# EAGLE design TouchDRO (EAGLE 7.5.0)
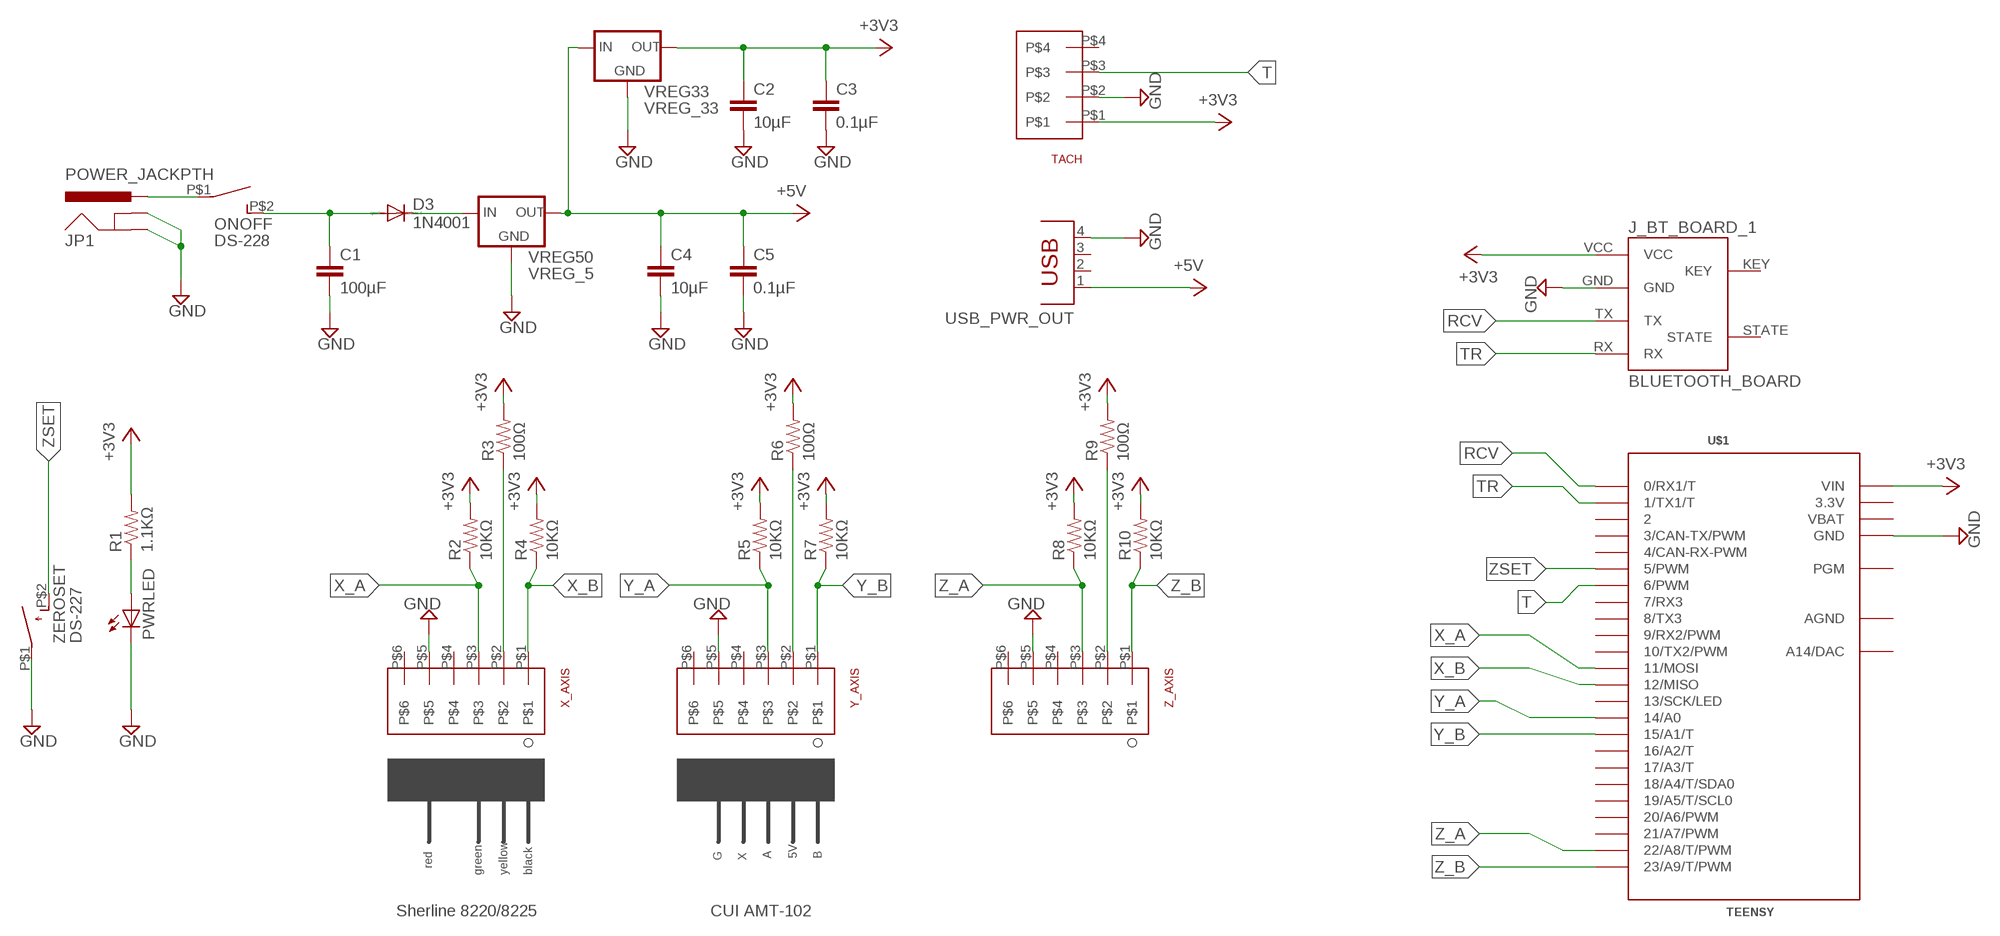
[diagram p0: schematic, sheet 1]

## Parts
C1  100µF  CAPEZ  [CAP-PTH-SMALLEZ]
C2  10µF  CAPEZ  [CAP-PTH-SMALLEZ]
C3  0.1µF  CAPEZ  [CAP-PTH-SMALLEZ]
C4  10µF  CAPEZ  [CAP-PTH-SMALLEZ]
C5  0.1µF  CAPEZ  [CAP-PTH-SMALLEZ]
D3  1N4001  DIODE-DO41-10  [DO41-10]
J_BT_BOARD_1  BLUETOOTH_BOARD  [BT_BOARD_FOOTPRINT]
JP1  POWER_JACKPTH  [POWER_JACK_PTH]
ONOFF  DS-228  [DS-EXT]
PWRLED  LED3MM  [LED3MM]
R1  1.1KΩ  RESISTOREZ  [AXIAL-0.3EZ]
R2  10KΩ  RESISTOREZ  [AXIAL-0.3EZ]
R3  100Ω  RESISTOREZ  [AXIAL-0.3EZ]
R4  10KΩ  RESISTOREZ  [AXIAL-0.3EZ]
R5  10KΩ  RESISTOREZ  [AXIAL-0.3EZ]
R6  100Ω  RESISTOREZ  [AXIAL-0.3EZ]
R7  10KΩ  RESISTOREZ  [AXIAL-0.3EZ]
R8  10KΩ  RESISTOREZ  [AXIAL-0.3EZ]
R9  100Ω  RESISTOREZ  [AXIAL-0.3EZ]
R10  10KΩ  RESISTOREZ  [AXIAL-0.3EZ]
TACH  KF2510_4PIN  [KF2510_4PIN]
U$1  TEENSY  TEENSY_3.1_BASIC  [TEENSY_3.1_BASIC]
USB_PWR_OUT  USBTYPEA  [USBTYPEA]
VREG33  VREG_33  [TO220]
VREG50  VREG_5  [TO220]
X_AXIS  KF2510_6PIN  [KF2510_6PIN]
Y_AXIS  KF2510_6PIN  [KF2510_6PIN]
Z_AXIS  KF2510_6PIN  [KF2510_6PIN]
ZEROSET  DS-227  [DS-EXT]

## Nets
+3V3: C2.1 C3.1 J_BT_BOARD_1.VCC R1.P$2 R2.P$2 R3.P$2 R4.P$2 R5.P$2 R6.P$2 R7.P$2 R8.P$2 R9.P$2 R10.P$2 TACH.P$1 U$1.VIN VREG33.OUT
+5V: C4.1 C5.1 USB_PWR_OUT.1 VREG33.IN VREG50.OUT
D1: D3.C VREG50.IN
GND: C1.2 C2.2 C3.2 C4.2 C5.2 J_BT_BOARD_1.GND JP1.GND JP1.GNDBREAK PWRLED.K(C) TACH.P$2 U$1.GND U$1.GND1(GND) USB_PWR_OUT.4 VREG33.GND VREG50.GND X_AXIS.P$5 Y_AXIS.P$5 Z_AXIS.P$5 ZEROSET.P$1(P)
N$1: PWRLED.A R1.P$1
N$3: R9.P$1 Z_AXIS.P$2
N$5: R6.P$1 Y_AXIS.P$2
N$6: JP1.PWR ONOFF.P$1(P)
N$7: R3.P$1 X_AXIS.P$2
ONOFF: C1.1 D3.A ONOFF.P$2(S)
RCV: J_BT_BOARD_1.TX U$1.0(0/RX1/T)
T: TACH.P$3 U$1.6(6/PWM)
TR: J_BT_BOARD_1.RX U$1.1(1/TX1/T)
X_A: R2.P$1 U$1.11(11/MOSI) X_AXIS.P$3
X_B: R4.P$1 U$1.12(12/MISO) X_AXIS.P$1
Y_A: R5.P$1 U$1.14/A0 Y_AXIS.P$3
Y_B: R7.P$1 U$1.15/A1(15/A1/T) Y_AXIS.P$1
Z_A: R8.P$1 U$1.22/A8(22/A8/T/PWM) Z_AXIS.P$3
Z_B: R10.P$1 U$1.23/A9(23/A9/T/PWM) Z_AXIS.P$1
ZSET: U$1.5(5/PWM) ZEROSET.P$2(S)
Unconnected: J_BT_BOARD_1.KEY J_BT_BOARD_1.STATE TACH.P$4 U$1.2 U$1.3(3/CAN-TX/PWM) U$1.4(4/CAN-RX-PWM) U$1.7(7/RX3) U$1.8(8/TX3) U$1.9(9/RX2/PWM) U$1.10(10/TX2/PWM) U$1.13(13/SCK/LED) U$1.16/A2(16/A2/T) U$1.17/A3(17/A3/T) U$1.18/A4(18/A4/T/SDA0) U$1.19/A5(19/A5/T/SCL0) U$1.20/A6(20/A6/PWM) U$1.21/A7(21/A7/PWM) U$1.A14(A14/DAC) U$1.PGM USB_PWR_OUT.2 USB_PWR_OUT.3 X_AXIS.P$4 X_AXIS.P$6 Y_AXIS.P$4 Y_AXIS.P$6 Z_AXIS.P$4 Z_AXIS.P$6

## Notes on the sheet
- G | X | A | 5V | B
- red
- green | yellow | black
- Sherline 8220/8225 | CUI AMT-102

## Power pins joined to a net without a drawn wire
3.3V: U$1.3.3V U$1.3.3V1(3.3V)
AGND: U$1.AGND
VBAT: U$1.VBAT

## Library data of the parts
C1-C5 = SparkFun-Passives:CAP: Capacitor Standard 0603 ceramic capacitor, and 0.1" leaded capacitor.
D3 = diode:DIODE-: DIODE
J_BT_BOARD_1 = Bluetooth HC-05:BLUETOOTH_BOARD: Bluetooth Board V1.05
JP1 = SparkFun-Connectors:POWER_JACK: Power Jack This is the standard 5.5mm barrel jack for power. The PTH is the most common, proven, reliable, footprint. The Slot footprint only works if the mill layer is transmitted to the PCB fab house so be warned. Mating wall wart : TOL-00298 (and others); PROD_ID: CONN-08197
ONOFF = Switches:DS-228
PWRLED = led:LED: LED OSRAM: - CHIPLED LG R971, LG N971, LY N971, LG Q971, LY Q971, LO R971, LY R971 LH N974, LH R974 LS Q976, LO Q976, LY Q976 LO Q996 - Hyper CHIPLED LW Q18S LB Q993, LB Q99A, LB R99A - SideLED LS A670, LO A670, LY A670, LG A670, LP A670 LB A673, LV A673, LT A673, LW A673 LH A674 LY A675 LS A676, LA A676, LO A676, LY A676, LW A676 LS A679, LY A679, LG A679 - Hyper Micro SIDELED® LS Y876, LA Y876, LO Y876, LY Y876 LT Y87S - SmartLED LW L88C, LW L88S LB L89C, LB L89S, LG L890 LS L89K, LO L89K, LY L89K LS L896, LA L896, LO L896, LY L896 - TOPLED LS T670, LO T670, LY T670, LG T670, LP T670 LSG T670, LSP T670, LSY T670, LOP T670, LYG T670 LG T671, LOG T671, LSG T671 LB T673, LV T673, LT T673, LW T673 LH T674 LS T676, LA T676, LO T676, LY T676, LB T676, LH T676, LSB T676, LW T676 LB T67C, LV T67C, LT T67C, LS T67K, LO T67K, LY T67K, LW E67C LS E67B, LA E67B, LO E67B, LY E67B, LB E67C, LV E67C, LT E67C LW T67C LS T679, LY T679, LG T679 LS T770, LO T770, LY T770, LG T770, LP T770 LB T773, LV T773, LT T773, LW T773 LH T774 LS E675, LA E675, LY E675, LS T675 LS T776, LA T776, LO T776, LY T776, LB T776 LHGB T686 LT T68C, LB T68C - Hyper Mini TOPLED® LB M676 - Mini TOPLED Santana® LG M470 LS M47K, LO M47K, LY M47K Source: http://www.osram.convergy.de LUXEON: - LUMILED® LXK2-PW12-R00, LXK2-PW12-S00, LXK2-PW14-U00, LXK2-PW14-V00 LXK2-PM12-R00, LXK2-PM12-S00, LXK2-PM14-U00 LXK2-PE12-Q00, LXK2-PE12-R00, LXK2-PE12-S00, LXK2-PE14-T00, LXK2-PE14-U00 LXK2-PB12-K00, LXK2-PB12-L00, LXK2-PB12-M00, LXK2-PB14-N00, LXK2-PB14-P00, LXK2-PB14-Q00 LXK2-PR12-L00, LXK2-PR12-M00, LXK2-PR14-Q00, LXK2-PR14-R00 LXK2-PD12-Q00, LXK2-PD12-R00, LXK2-PD12-S00 LXK2-PH12-R00, LXK2-PH12-S00 LXK2-PL12-P00, LXK2-PL12-Q00, LXK2-PL12-R00 Source: www.luxeon.com KINGBRIGHT: KA-3528ASYC Source: www.kingbright.com
R1-R10 = SparkFun-Passives:RESISTOR: Resistor Basic schematic elements and footprints for 0603, 1206, and PTH resistors.
TACH = Connectors:KF2510_4PIN
U$1 = Teensy_3_Series_Board_v1.0:TEENSY_3.1_BASIC: Footprint for Teensy 3.1 board using all pin connections on the outer perimeter
USB_PWR_OUT = USB:USBTYPEA: BERG USB connector; OC_FARNELL: unknown; OC_NEWARK: unknown
VREG33 = regulators:VREG_33: Voltage Regulator Standard LM317 adjustable voltage regulator. AOI (Adjust Output Input). Google 'LM317 Calculator' for easy to use app to get the two resistor values needed. 240/720 for 5V output. 240/390 for 3.3V output. Spark Fun Electronics SKU : COM-00527
VREG50 = regulators:VREG_5: Voltage Regulator Standard 3.3V
X_AXIS Y_AXIS Z_AXIS = Connectors:KF2510_6PIN
ZEROSET = Switches:DS-227

## Board
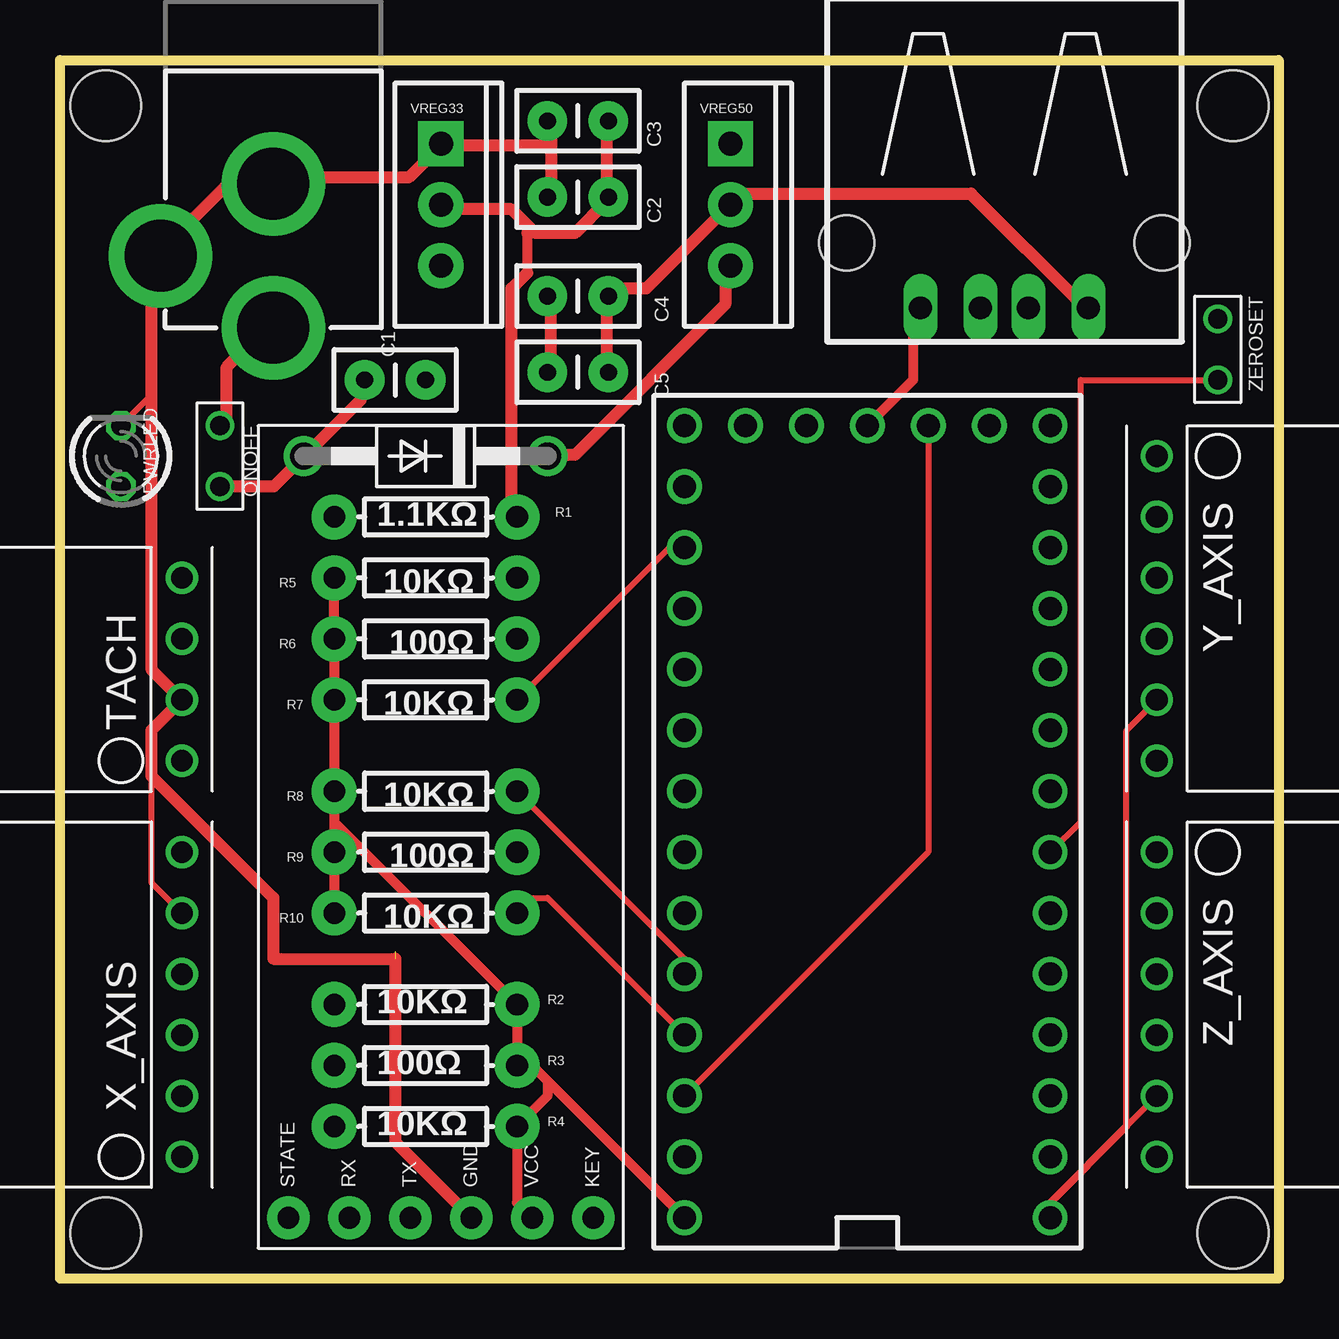
[diagram p1: board, top side]
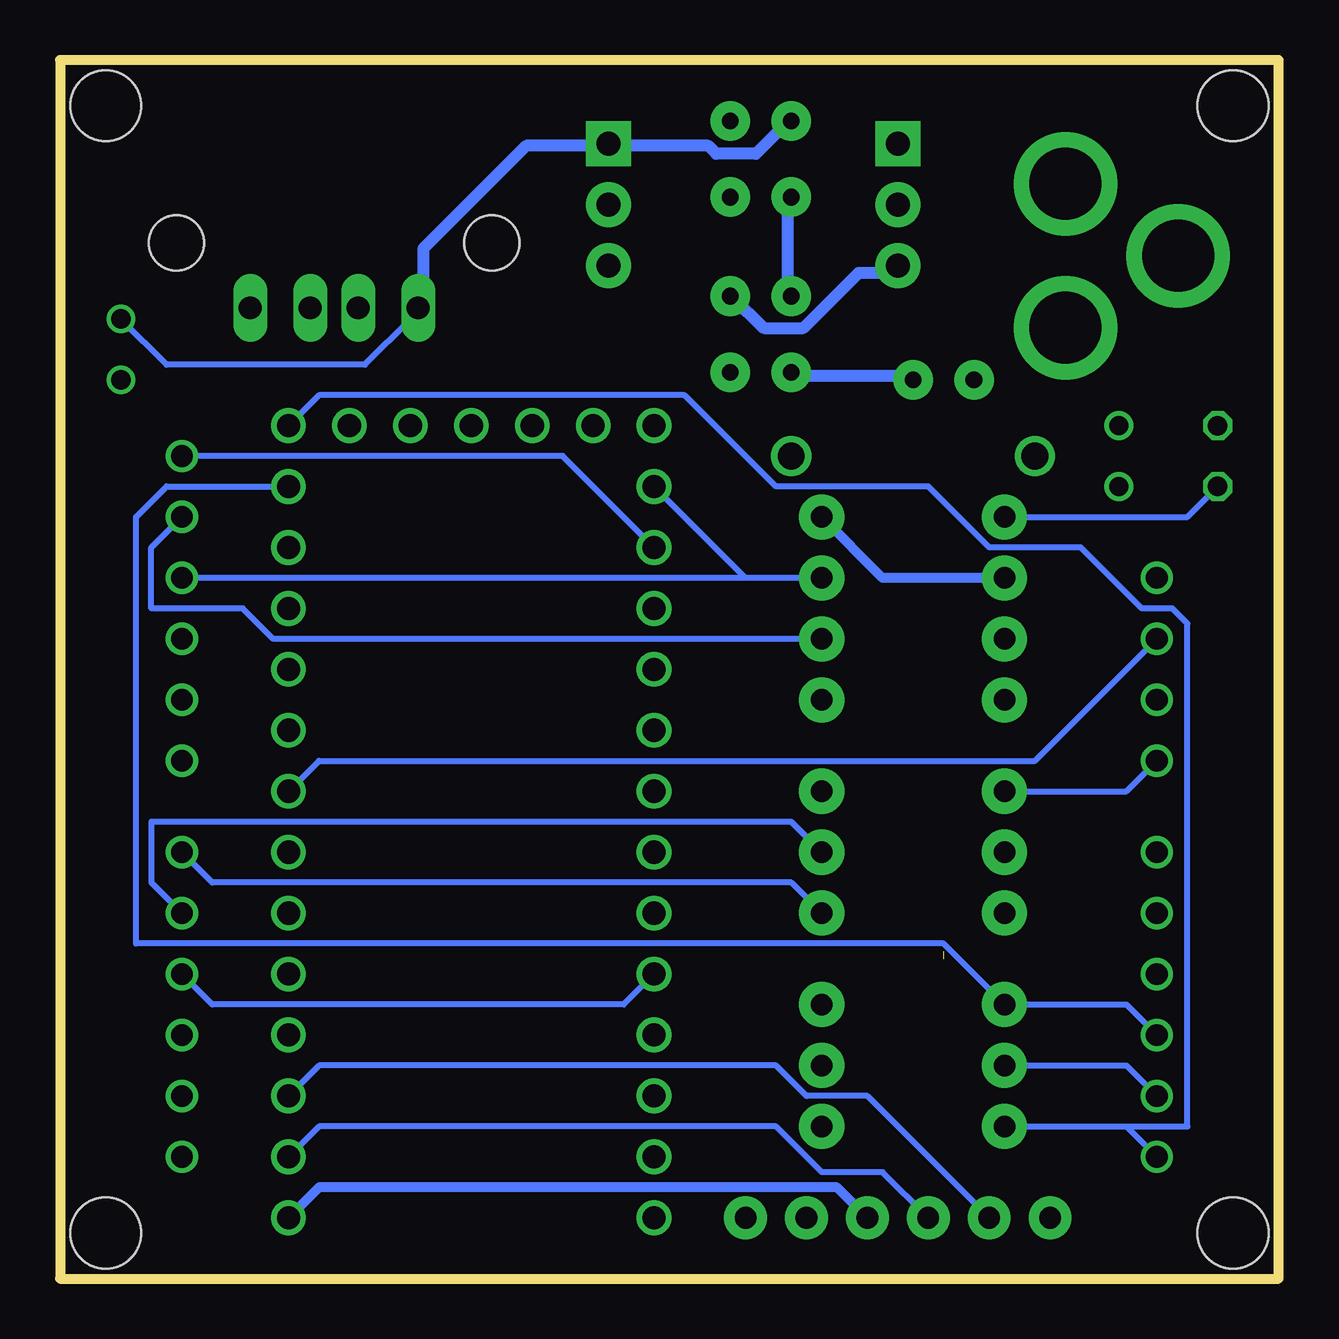
[diagram p2: board, bottom side, seen from below]

Size 50.8 x 50.8 mm. Coordinates in mm from the lower left corner, seen from the top.
Outline: 0,0 0,50.8 50.8,50.8 50.8,0 0,0
Copper layers (1*16): Top 0.0356mm / dielectric 1.5011mm / Bottom 0.0356mm
Design rules "LaenPCBOrder *": minimum track width 6mil, minimum drill 13mil, track to track 6mil, track to pad 6mil, pad to pad 6mil, via to via 6mil, smd to smd 6mil, copper to edge 15mil, drill to drill 6mil, minimum pad ring 7mil, minimum via ring 7mil, stop-mask expansion 3mil, vias tented up to drill 0mil, thermal gap 10mil
Holes 2.95 mm at 48.9,1.91 48.9,48.9 1.91,48.9 1.91,1.91

### Footprints (pad centres in the part's own frame; a part is rotated, then mirrored left to right if it is on the bottom)
CAP-PTH-SMALLEZ = drill 0.7 pad 1.651: 1 0,0; 2 2.54,0
DO41-10 = drill 1.118: A 5.08,0; C -5.08,0
BT_BOARD_FOOTPRINT = drill 0.9 pad 1.778: GND -16.51,-1.27; KEY -16.51,-6.35; RX -16.51,3.81; STATE -16.51,6.35; TX -16.51,1.27; VCC -16.51,-3.81
POWER_JACK_PTH = drill 2.997 pad 4.318: GND 0,7.7; GNDBREAK 4.7,10.7; PWR 0,13.7
DS-EXT = drill 0.8: P$1 -2.54,0; P$2 0,0
LED3MM = drill 0.813 octagon: A -1.27,0; K 1.27,0
AXIAL-0.3EZ = drill 0.9 pad 1.88: P$1 -3.81,0; P$2 3.81,0
KF2510_4PIN = drill 0.9: P$1 0,0; P$2 2.54,0; P$3 5.08,0; P$4 7.62,0
TEENSY_3.1_BASIC = drill 0.965: 0 -7.62,13.97; 1 -7.62,11.43; 2 -7.62,8.89; 3 -7.62,6.35; 3.3V 7.62,11.43; 3.3V1 -2.54,-16.51; 4 -7.62,3.81; 5 -7.62,1.27; 6 -7.62,-1.27; 7 -7.62,-3.81; 8 -7.62,-6.35; 9 -7.62,-8.89; 10 -7.62,-11.43; 11 -7.62,-13.97; 12 -7.62,-16.51; 13 7.62,-16.51; 14/A0 7.62,-13.97; 15/A1 7.62,-11.43; 16/A2 7.62,-8.89; 17/A3 7.62,-6.35; 18/A4 7.62,-3.81; 19/A5 7.62,-1.27; 20/A6 7.62,1.27; 21/A7 7.62,3.81; 22/A8 7.62,6.35; 23/A9 7.62,8.89; A14 5.08,-16.51; AGND 7.62,13.97; GND -7.62,16.51; GND1 0,-16.51; PGM 2.54,-16.51; VBAT -5.08,-16.51; VIN 7.62,16.51
USBTYPEA = drill 0.95 long: 1 -3.5,2.71; 2 -1,2.71; 3 1,2.71; 4 3.5,2.71 | hole 2.3: -6.57,0; 6.57,0
TO220 = drill 1 pad 1.88 square: GND -2.54,0 | drill 1 pad 1.88: IN 2.54,0; OUT 0,0
KF2510_6PIN = drill 0.9: P$1 0,0; P$2 2.54,0; P$3 5.08,0; P$4 7.62,0; P$5 10.16,0; P$6 12.7,0

### Placement (x,y rotation side)
C1  12.7,37.47 0 top
C2  22.86,45.09 180 top
C3  22.86,48.26 180 top
C4  22.86,40.96 180 top
C5  22.86,37.78 180 top
D3  15.24,34.29 180 top
J_BT_BOARD_1  15.88,19.05 90 top
JP1  8.89,53.34 180 top
ONOFF  6.67,33.02 270 top
PWRLED  2.54,34.29 90 top
R1  15.24,31.75 0 top
R2  15.24,11.43 0 top
R3  15.24,8.89 0 top
R4  15.24,6.35 0 top
R5  15.24,29.21 180 top
R6  15.24,26.67 180 top
R7  15.24,24.13 180 top
R8  15.24,20.32 180 top
R9  15.24,17.78 180 top
R10  15.24,15.24 180 top
TACH  5.08,21.59 90 top
U$1  33.66,19.05 180 top
USB_PWR_OUT  39.37,43.18 180 top
VREG33  15.88,44.77 270 top
VREG50  27.94,44.77 270 top
X_AXIS  5.08,5.08 90 top
Y_AXIS  45.72,34.29 270 top
Z_AXIS  45.72,17.78 270 top
ZEROSET  48.26,37.47 270 top

### Tracks (layer width: path | path; a pad name or v marks a point on that pad's centre or on a via)
3.3V
  Top 0.254: U$1.3.3V 36.2,17.78 U$1.3.3V1
+3V3
  Top 0.406: J_BT_BOARD_1.VCC 19.05,3.17 R4.P$2 20.32,7.62 20.32,8.26 | 19.05,9.53 20.32,8.26 | 20.32,8.26 U$1.VIN | 19.05,9.53 R2.P$2 11.43,19.05 | 19.05,9.53 R3.P$2 | R10.P$2 R9.P$2 11.43,19.05 | 11.43,19.05 R8.P$2 R7.P$2 R6.P$2 R5.P$2 | 19.48,41.94 19.48,43.59
  Top 0.508: C3.1 22.78,48.21 22.78,45.24 C2.1 22.78,44.91 21.46,43.59 19.81,43.59 19.65,43.75 | 19.65,43.75 18.82,44.58 16.18,44.58 VREG33.OUT | 19.48,41.94 18.82,41.27 18.82,32.03 R1.P$2 | 19.48,43.59 19.65,43.75
  Bottom 0.254: TACH.P$1 6.35,20.32 R8.P$2
  Bottom 0.406: R1.P$2 16.51,29.21 R5.P$2
+5V
  Top 0.508: C5.1 22.78,37.97 22.78,40.95 C4.1 23.11,41.27 24.43,41.27 27.74,44.58 VREG50.OUT 28.07,44.91 28.4,45.24 37.97,45.24 42.6,40.62 USB_PWR_OUT.1
  Bottom 0.508: VREG33.IN 16.18,41.94 17.5,41.94 19.81,39.62 21.46,39.62 22.78,40.95 C4.1
D1
  Top 0.508: D3.C 20.47,34.34 21.46,34.34 27.74,40.62 27.74,41.94 VREG50.IN
GND  (1 unrouted)
  Top 0.254: Z_AXIS.P$5 44.45,6.35 44.45,22.86 Y_AXIS.P$5 | X_AXIS.P$5 3.81,16.51 3.81,20.95 | 3.81,36.83 PWRLED.K | 3.81,42.55 JP1.GNDBREAK
  Top 0.305: 44.45,6.35 41.27,3.17 U$1.GND
  Top 0.406: U$1.GND1 35.56,37.47 35.56,40.01 USB_PWR_OUT.4
  Top 0.508: J_BT_BOARD_1.GND 13.97,5.71 13.97,13.34 8.89,13.34 8.89,15.88 3.81,20.95 3.81,22.86 TACH.P$2 3.81,25.4 3.81,36.83 3.81,42.55 | JP1.GNDBREAK 4.29,42.93 6.93,45.57 8.59,45.57 JP1.GND 8.91,45.9 14.53,45.9 15.85,47.22 VREG33.GND 16.18,47.22 20.47,47.22 | C4.2 20.47,40.95 20.47,37.97 C5.2 | 20.47,47.22 20.47,48.21 C3.2 | 20.47,47.22 20.47,45.24 C2.2
  Bottom 0.254: ZEROSET.P$1 46.35,38.1 38.1,38.1 36.2,40.01 USB_PWR_OUT.4
  Bottom 0.406: U$1.GND 40.01,3.81 18.41,3.81 J_BT_BOARD_1.GND
  Bottom 0.508: C1.2 15.52,37.64 20.14,37.64 C5.2 | C3.2 20.47,48.21 21.79,46.89 23.44,46.89 23.77,47.22 27.74,47.22 VREG50.GND 28.07,47.22 31.37,47.22 35.66,42.93 35.66,40.62 USB_PWR_OUT.4 | C4.2 20.47,41.27 20.47,44.91 C2.2
N$1
  Bottom 0.254: PWRLED.A 3.81,31.75 R1.P$1
N$3
  Bottom 0.254: Z_AXIS.P$2 46.99,16.51 46.99,19.05 20.32,19.05 R9.P$1
N$5
  Bottom 0.254: Y_AXIS.P$2 46.99,30.48 46.99,27.94 43.18,27.94 41.91,26.67 R6.P$1
N$6
  Top 0.508: ONOFF.P$1 6.93,35.66 6.93,37.97 8.59,39.62 JP1.PWR
N$7
  Bottom 0.254: X_AXIS.P$2 6.35,8.89 R3.P$1
ONOFF
  Top 0.508: ONOFF.P$2 8.91,33.02 9.91,34.01 D3.A 10.24,34.34 12.55,36.65 12.55,37.31 C1.1
RCV
  Bottom 0.254: U$1.0 40.01,6.35 20.95,6.35 19.05,4.45 16.51,4.45 J_BT_BOARD_1.TX
T
  Bottom 0.254: TACH.P$3 10.16,21.59 40.01,21.59 U$1.6
TR
  Bottom 0.254: U$1.1 40.01,8.89 20.95,8.89 19.68,7.62 17.14,7.62 J_BT_BOARD_1.RX
X_A
  Bottom 0.254: X_AXIS.P$3 6.35,11.43 R2.P$1 13.97,13.97 47.62,13.97 47.62,31.75 46.35,33.02 U$1.11
X_B
  Bottom 0.254: 6.35,6.35 X_AXIS.P$1 | R4.P$1 6.35,6.35 | U$1.12 40.01,36.83 24.77,36.83 20.95,33.02 14.61,33.02 12.06,30.48 8.26,30.48 5.71,27.94 4.45,27.94 3.81,27.3 3.81,6.35 6.35,6.35
Y_A
  Bottom 0.254: R5.P$1 22.23,29.21 | 22.23,29.21 Y_AXIS.P$3 | 22.23,29.21 U$1.14/A0
Y_B
  Top 0.254: R7.P$1 25.4,30.48 U$1.15/A1
  Bottom 0.254: Y_AXIS.P$1 29.84,34.29 U$1.15/A1
Z_A
  Top 0.254: R8.P$1 26.04,13.34 U$1.22/A8
  Bottom 0.254: Z_AXIS.P$3 44.45,11.43 27.3,11.43 U$1.22/A8
Z_B
  Top 0.254: U$1.23/A9 20.32,15.88 19.05,15.88 R10.P$1
  Bottom 0.254: Z_AXIS.P$1 44.45,16.51 20.32,16.51 R10.P$1
ZSET
  Top 0.254: ZEROSET.P$2 42.55,37.47 42.55,19.05 U$1.5